# Altium schematic sheet MD070B_DRIVER.SchDoc
size 431 x 279 mm; Date: Not shown in title block; ApprovedBy: Not shown in title block; CheckedBy: Not shown in title block; Author: Not shown in title block; CompanyName: Not shown in title block; Engineer: Not shown in title block; Organization: Not shown in title block; Address1: Not shown in title block; Address2: Not shown in title block; Address3: Not shown in title block; Address4: Not shown in title block; DocumentNumber: 2; Revision: Use project parameter SCH_Rev; SheetNumber: 3; SheetTotal: 5; PageSetup: Record=PageOptions|CenterHorizontal=True|CenterVertical=True|PrintScale=1.00|XCorrection=1.00|YCorrection=1.00|PrintKind=0|BorderSize=5000000|LeftOffset=0|BottomOffset=0|Orientation=2|PaperLength=1000|PaperWidth=1000|Scale=100|PaperSource=15|PrintQuality=600|MediaType=1|DitherType=10|PaperKind=Letter|PrintScaleMode=1; CurrentTime: Not shown in title block; CurrentDate: Not shown in title block; Time: Not shown in title block; DocumentFullPathAndName: Not shown in title block; DocumentName: Not shown in title block; ModifiedDate: Not shown in title block; ImagePath: Not shown in title block
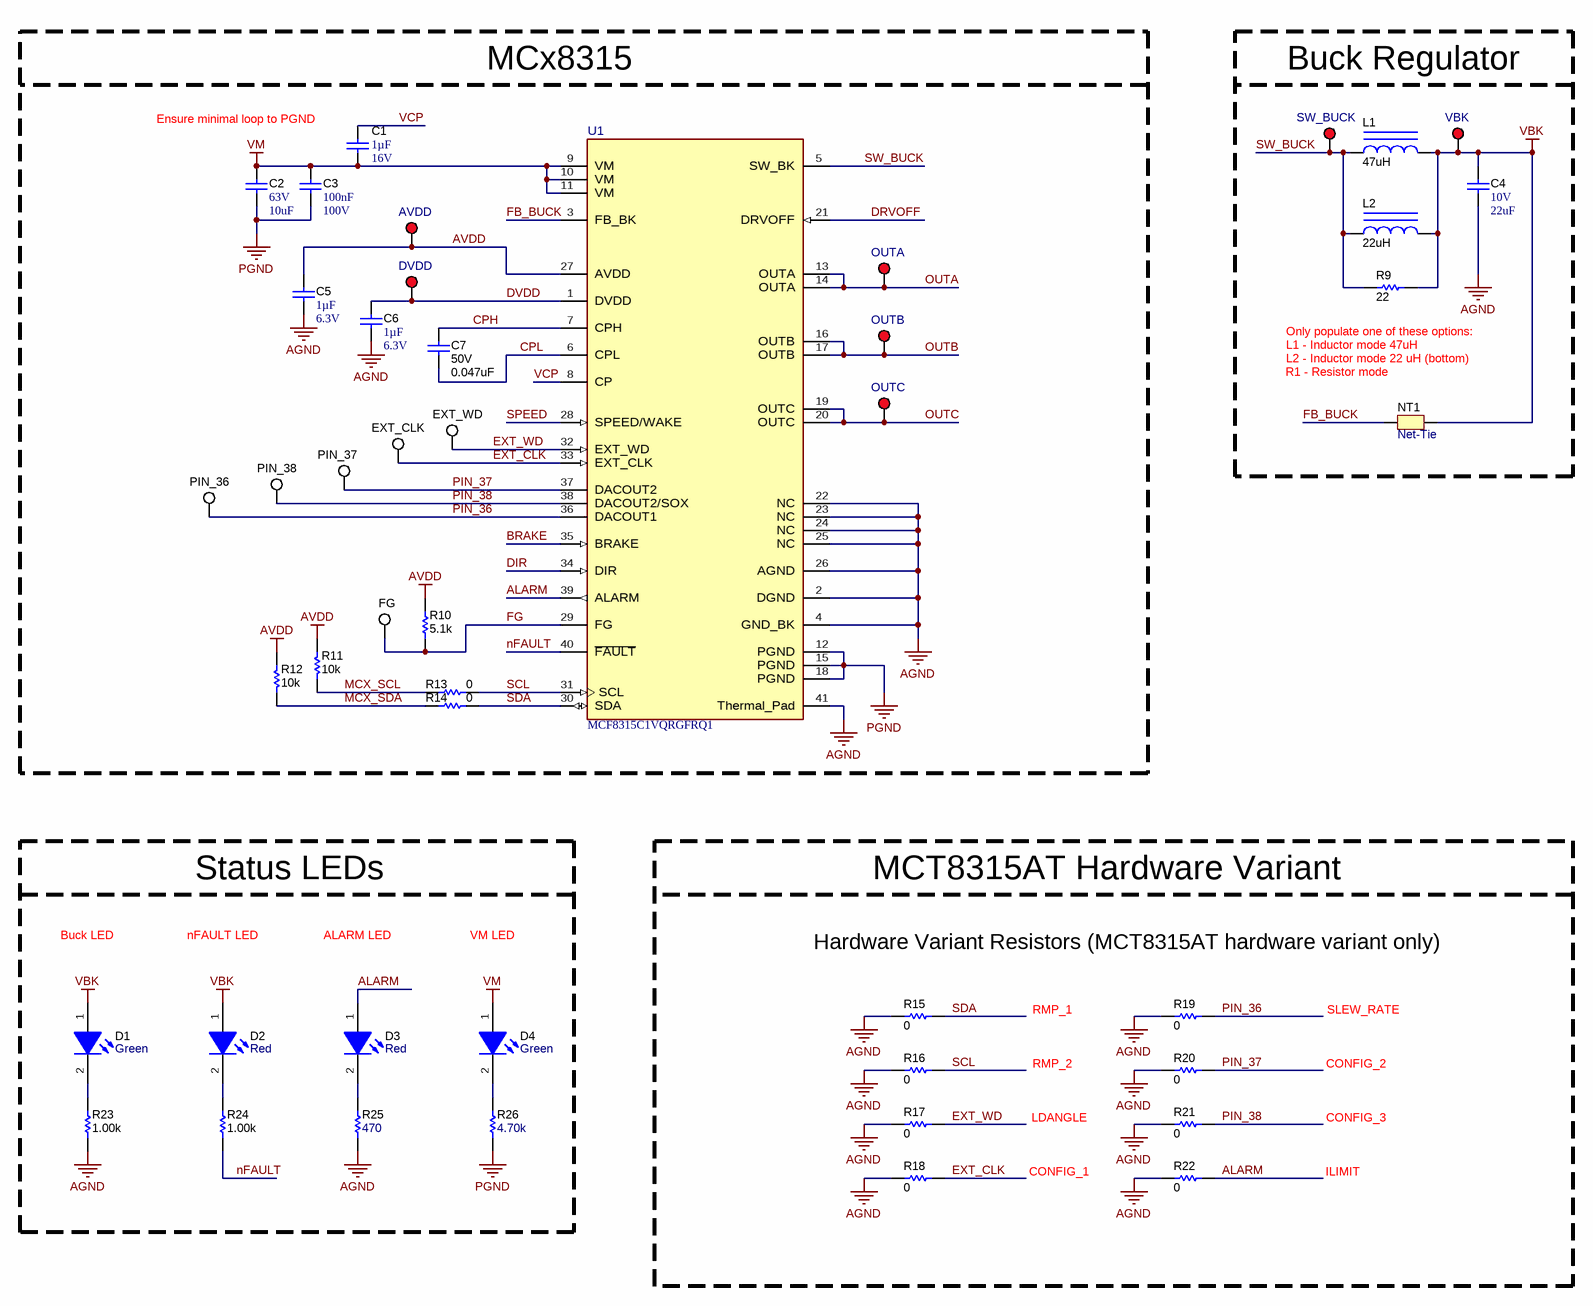
[diagram p0: MD070B_DRIVER.SchDoc]

## Parts
C1  Cap_F: 1µF  VDC_V: 16V  [0603L]  (hidden comment: EMK107B7105KAHT)
C2  VDC_V: 63V  ValueDisplayed: 10uF  [1210_270L]  (hidden comment: GRM32ER71J106KA12L)
C3  Cap_F: 100nF  VDC_V: 100V  [0603]  (hidden comment: GRM188R72A104KA35D)
C4  VDC_V: 10V  ValueDisplayed: 22uF  [1206_180L]  (hidden comment: GRM31CR71A226KE15L)
C5  Cap_F: 1µF  VDC_V: 6.3V  [0603L]  (hidden comment: C0603C105K9RACAUTO)
C6  Cap_F: 1µF  VDC_V: 6.3V  [0603L]  (hidden comment: C0603C105K9RACAUTO)
C7  VDC_V: 50V  ValueDisplayed: 0.047uF  [0402L]  (hidden comment: C1005X7R1H473K050BB)
D1  value Green  [LTST-C170KGKT_Green]  (hidden comment: LTST-C170KGKT)
D2  value Red  [LED_LTST-C170_Red]  (hidden comment: LTST-C170KRKT)
D3  value Red  [LED_LTST-C170_Red]  (hidden comment: LTST-C170KRKT)
D4  value Green  [LTST-C170KGKT_Green]  (hidden comment: LTST-C170KGKT)
L1  ValueDisplayed: 47uH  [WE-MAIA_3015]  (hidden comment: 78438335470)
L2  ValueDisplayed: 22uH  [WE-MAIA_3015]  (hidden comment: 78438335220)
NT1  Net-Tie  [Net-Tie_10mil]  (net tie, no BOM)
R9  ValueDisplayed: 22  [2512]  (hidden comment: CRCW251222R0JNEGHP)
R10  ValueDisplayed: 5.1k  [0603L]  (hidden comment: CRCW06035K10JNEA)
R11  ValueDisplayed: 10k  [0603]  (hidden comment: CRCW060310K0JNEA)
R12  ValueDisplayed: 10k  [0603]  (hidden comment: CRCW060310K0JNEA)
R13  ValueDisplayed: 0  [0603L]  (hidden comment: ERJ-3GEY0R00V)
R14  ValueDisplayed: 0  [0603L]  (hidden comment: ERJ-3GEY0R00V)
R15  ValueDisplayed: 0  [0603L]  (hidden comment: ERJ-3GEY0R00V)
R16  ValueDisplayed: 0  [0603L]  (hidden comment: ERJ-3GEY0R00V)
R17  ValueDisplayed: 0  [0603L]  (hidden comment: ERJ-3GEY0R00V)
R18  ValueDisplayed: 0  [0603L]  (hidden comment: ERJ-3GEY0R00V)
R19  ValueDisplayed: 0  [0603L]  (hidden comment: ERJ-3GEY0R00V)
R20  ValueDisplayed: 0  [0603L]  (hidden comment: ERJ-3GEY0R00V)
R21  ValueDisplayed: 0  [0603L]  (hidden comment: ERJ-3GEY0R00V)
R22  ValueDisplayed: 0  [0603L]  (hidden comment: ERJ-3GEY0R00V)
R23  ValueDisplayed: 1.00k  [0603]  (hidden comment: RC0603FR-071KL)
R24  ValueDisplayed: 1.00k  [0603]  (hidden comment: RC0603FR-071KL)
R25  ValueDisplayed: 470  [0603]  (hidden comment: RC0603JR-07470RL)
R26  ValueDisplayed: 4.70k  [0603L]  (hidden comment: RT0603BRD074K7L)
TP5  SW_BUCK  [Keystone5000]
TP6  VBK  [Keystone5000]
TP7  AVDD  [Keystone5000]
TP8  DVDD  [Keystone5000]
TP9  OUTA  [Keystone5000]
TP10  OUTB  [Keystone5000]
TP11  OUTC  [Keystone5000]
TP12  EXT_WD  [Keystone5002]
TP13  EXT_CLK  [Keystone5002]
TP14  PIN_37  [Keystone5002]
TP15  PIN_38  [Keystone5002]
TP16  PIN_36  [Keystone5002]
TP17  FG  [Keystone5002]
U1  MCF8315C1VQRGFRQ1  [RGF0040F-MFG]

## Blocks framed on the sheet
MCx8315: C1-C3 C5-C7 R10-R14 TP7-TP17 U1
Buck Regulator: C4 L1 L2 NT1 R9 TP5 TP6
Status LEDs: D1-D4 R23-R26
MCT8315AT Hardware Variant: R15-R22

## Nets
AGND: C4.2 C5.1 C6.1 R15.2 R16.2 R17.2 R18.2 R19.2 R20.2 R21.2 R22.2 R23.1 R25.1 U1.2(DGND) U1.4(GND_BK) U1.22(NC) U1.23(NC) U1.24(NC) U1.25(NC) U1.26(AGND) U1.41(Thermal_Pad)
AVDD: C5.2 R10.2 R11.1 R12.1 TP7.1 U1.27(AVDD)
PGND: C2.2 C3.2 R26.1 U1.12(PGND) U1.15(PGND) U1.18(PGND)
VBK: C4.1 D1.1(A) D2.1(A) L1.2 L2.2 NT1.2 R9.2 TP6.1
VM: C1.2 C2.1 C3.1 D4.1(A) U1.9(VM) U1.10(VM) U1.11(VM)
ALARM: D3.1(A) R22.1 U1.39(ALARM)
BRAKE: U1.35(BRAKE)
CPH: C7.1 U1.7(CPH)
CPL: C7.2 U1.6(CPL)
DIR: U1.34(DIR)
DRVOFF: U1.21(DRVOFF)
DVDD: C6.2 TP8.1 U1.1(DVDD)
EXT_CLK: R18.1 TP13.1 U1.33(EXT_CLK)
EXT_WD: R17.1 TP12.1 U1.32(EXT_WD)
FB_BUCK: NT1.1 U1.3(FB_BK)
FG: R10.1 TP17.1 U1.29(FG)
MCX_SCL: R11.2 R13.1
MCX_SDA: R12.2 R14.1
nFAULT: R24.1 U1.40(~{FAULT})
OUTA: TP9.1 U1.13(OUTA) U1.14(OUTA)
OUTB: TP10.1 U1.16(OUTB) U1.17(OUTB)
OUTC: TP11.1 U1.19(OUTC) U1.20(OUTC)
PIN_36: R19.1 TP16.1 U1.36(DACOUT1)
PIN_37: R20.1 TP14.1 U1.37(DACOUT2)
PIN_38: R21.1 TP15.1 U1.38(DACOUT2/SOX)
SCL: R13.2 R16.1 U1.31(SCL)
SDA: R14.2 R15.1 U1.30(SDA)
SPEED: U1.28(SPEED/WAKE)
SW_BUCK: L1.1 L2.1 R9.1 TP5.1 U1.5(SW_BK)
VCP: C1.1 U1.8(CP)
NetD1_2: D1.2(K) R23.2
NetD2_2: D2.2(K) R24.2
NetD3_2: D3.2(K) R25.2
NetD4_2: D4.2(K) R26.2

## Notes on the sheet
- Ensure minimal loop to PGND
- (near NT1) R1 - Resistor mode
- L1 - Inductor mode 47uH
- L2 - Inductor mode 22 uH (bottom)
- (near R9) Only populate one of these options:
- Buck LED
- nFAULT LED
- ALARM LED
- VM LED
- Hardware Variant Resistors (MCT8315AT hardware variant only)
- RMP_1
- RMP_2
- CONFIG_2
- SLEW_RATE
- LDANGLE
- CONFIG_3
- CONFIG_1
- ILIMIT
- Drawn By:
- SVN Rev:
- Number:
- TID #:
- Orderable:
- Rev:
- Sheet Title:
- File:
- Project Title:
- Designed for:
- Assembly Variant:
- Mod. Date:
- Sheet:
- Size:
- of
- B
- http://www.ti.com
- Texas Instruments and/or its licensors do not warrant the accuracy or completeness of this specification or any information contained therein. Texas Instruments and/or its licensors do not warrant that this design will meet the specifications, will be suitable for your application or fit for any particular purpose, or will operate in an implementation. Texas Instruments and/or its licensors do not warrant that the design is production worthy. You should completely validate and test your design implementation to confirm the system functionality for your application.
- Engineer:
- Contact:
- © Texas Instruments

## Library data of the parts
C1 = CMP-0080104-1: CAP, CERM, 1 µF, 16 V,+/- 10%, X7R, AEC-Q200 Grade 1, 0603; Manufacturer: Taiyo Yuden; SizeAreaWB_mm2: 4.68; SizeArea_mm2: 1.28; AEC Qualified: Y; AEC Category: Q200; Value: 1uF; TaMax_C: 125°C; SizeZ_mm: 1; Polarized: N; TaMin_C: -55°C; SizeY_mm: 0.8; U/M: EA; SizeX_mm: 1.6; Cap_Case: 0603; ComponentLink1Description: Datasheet link; RoHS: Y; Supplier Part Number 3: 963-EMK107B7105KAHT; Tolerance_%: 10%; Supplier 1: Digi-Key; PackageReference: 0603; Technology: Ceramic; PartNumber: EMK107B7105KAHT; TempCo: X7R; Supplier Part Number 2: 68X1305; Supplier 2: Newark; AEC Grade: 1; Value2: 16V; ComponentLink1URL: https://www.yuden.co.jp/productdata/catalog/mlcc01_hq_e.pdf; CompType: Capacitor; MountType: SMT; Supplier Part Number 1: 587-3305-1-ND; Supplier 3: Mouser; ValueDisplayed: 1µF
C2 = CMP-0009229-2: CAP, CERM, 10 uF, 63 V, +/- 10%, X7R, 1210; Manufacturer: MuRata; TaMin_C: -55°C; Polarized: N; SizeAreaWB_mm2: 14.7; Value1: Unknown; U/M: EA; Value: 10uF; TaMax_C: 125°C; SizeZ_mm: 2.7; SizeX_mm: 3.2; SizeY_mm: 2.5; Cap_Case: 1210; SizeArea_mm2: 8; Cap_F: 10µF; AEC Category: Q200; Supplier Part Number 2: 81-GRM32ER71J106KA2L; Publisher: Texas Instruments; Supplier 2: Mouser; TempCo: X7R; Published: 2008-06-19; RoHS: Y; MountType: SMT; Supplier 1: Digi-Key; PackageReference: 1210; Tolerance_%: 10%; Value2: 63V; CompType: Capacitor; LatestRevisionDate: 2017-03-09; PartNumber: GRM32ER71J106KA12L; AEC Qualified: N; ComponentLink1Description: Datasheet link; AEC Grade: N/A; Supplier Part Number 1: 490-9970-1-ND; Technology: Ceramic; ComponentLink1URL: http://psearch.en.murata.com/capacitor/product/GRM32ER71J106KA12%23.pdf
C3 = CMP-0007469-4: CAP, CERM, 0.1 uF, 100 V, +/- 10%, X7R, 0603; Manufacturer: MuRata; TaMin_C: -55°C; TaMax_C: 125°C; SizeY_mm: 0.8; ValueDisplayed: 0.1uF; SizeZ_mm: 1; Polarized: N; Value1: Unknown; U/M: EA; SizeAreaWB_mm2: 4.68; AEC Category: Q200; SizeArea_mm2: 1.28; Value: 0.1uF; SizeX_mm: 1.6; CompType: Capacitor; AEC Qualified: ?; Supplier 3: Farnell; Technology: Ceramic; TempCo: X7R; RoHS: Y; Cap_Case: 0603; Supplier 1: Digi-Key; Supplier Part Number 1: 490-3285-1-ND; Tolerance_%: 10%; MountType: SMT; ComponentLink1Description: Datasheet link; Supplier Part Number 2: 81-GRM188R72A104KA35; Value2: 100V; PartNumber: GRM188R72A104KA35D; Supplier 2: Mouser; ComponentLink1URL: http://search.murata.co.jp/Ceramy/PnsearchViewAction.do?HnOFG=ON&HnNFG=ON&SEL_CNT=50&sLang=en&sKey=GRM188R72A104KA35D&x=9&y=9&search=startwith; Supplier Part Number 3: 1828921; PackageReference: 0603; Publisher: Texas Instruments; Published: 2008-06-19; LatestRevisionDate: 2017-03-09
C4 = CMP-0008959-2: CAP, CERM, 22 uF, 10 V, +/- 10%, X7R, 1206; Manufacturer: MuRata; TaMin_C: -55°C; Polarized: N; SizeAreaWB_mm2: 10.92; Value1: Unknown; U/M: EA; Value: 22uF; TaMax_C: 125°C; SizeZ_mm: 1.8; SizeX_mm: 3.2; SizeY_mm: 1.6; Cap_Case: 1206; SizeArea_mm2: 5.12; Cap_F: 22µF; AEC Category: Q200; Supplier Part Number 2: 81-GRM31CR71A226K15L; Publisher: Texas Instruments; Supplier 2: Mouser; Supplier Part Number 3: 1797016; TempCo: X7R; Supplier 3: Farnell; Published: 2008-06-19; RoHS: Y; MountType: SMT; Supplier 1: Digi-Key; PackageReference: 1206; Tolerance_%: 10%; Value2: 10V; CompType: Capacitor; LatestRevisionDate: 2017-03-09; PartNumber: GRM31CR71A226KE15L; AEC Qualified: ?; ComponentLink1Description: Datasheet link; Supplier Part Number 1: 490-5309-1-ND; Technology: Ceramic; ComponentLink1URL: http://search.murata.co.jp/Ceramy/PnsearchViewAction.do?HnOFG=ON&HnNFG=ON&SEL_CNT=50&sLang=en&sKey=GRM31CR71A226KE15L&x=9&y=9&search=startwith
C5 C6 = CMP-0086190-1: CAP, CERM, 1 µF, 6.3 V,+/- 10%, X7R, AEC-Q200 Grade 1, 0603; Manufacturer: Kemet; SizeArea_mm2: 1.28; Cap_Case: 0603; SizeY_mm: 0.8; AEC Category: Q200; AEC Qualified: Y; TaMax_C: 125°C; SizeZ_mm: 1; SizeX_mm: 1.6; Polarized: N; Value: 1uF; SizeAreaWB_mm2: 4.68; TaMin_C: -55°C; U/M: EA; ComponentLink1URL: https://content.kemet.com/datasheets/KEM_C1023_X7R_AUTO_SMD.pdf; CompType: Capacitor; PackageReference: 0603; Value2: 6.3V; Technology: Ceramic; RoHS: Y; MountType: SMT; PartNumber: C0603C105K9RACAUTO; AEC Grade: 1; ComponentLink1Description: Datasheet link; TempCo: X7R; Tolerance_%: 10%; ValueDisplayed: 1µF
C7 = CMP-0006298-2: CAP, CERM, 0.047 uF, 50 V, +/- 10%, X7R, 0402; Manufacturer: TDK; TaMin_C: -55°C; ESR_ohm: 0.06407; Polarized: N; SizeAreaWB_mm2: 3; Value1: 0.06407 ohm; U/M: EA; SizeZ_mm: 0.6; SizeX_mm: 1; SizeY_mm: 0.5; Cap_Case: 0402; Cap_F: 47nF; IRMS_A: 646.122mA; AEC Category: Q200; TaMax_C: 125°C; ComponentLink1URL: https://product.tdk.com/en/search/capacitor/ceramic/mlcc/info?part_no=C1005X7R1H473K050BB; Supplier Part Number 2: 04X3233; Publisher: Texas Instruments; Supplier 2: Newark; Supplier Part Number 3: 810-C1005X7R1H473K; TempCo: X7R; Supplier 3: Mouser; Published: 2008-06-19; RoHS: Y; MountType: SMT; Value: 0.047uF; Supplier 1: Digi-Key; PackageReference: 0402; Tolerance_%: 10%; Value2: 50V; SizeArea_mm2: 0.5; CompType: Capacitor; LatestRevisionDate: 2017-03-09; PartNumber: C1005X7R1H473K050BB; AEC Qualified: N; ComponentLink1Description: Datasheet link; AEC Grade: N/A; Supplier Part Number 1: 445-7336-1-ND; Technology: Ceramic
D1 D4 = CMP-0002888-2: LED, Green, SMD; Manufacturer: Lite-On; Io_A: 20mA; Value1: W; Vf_V: 2V; Type: AlInGaP; ComponentLink1URL: http://optoelectronics.liteon.com/upload/download/DS22-2000-073/S_110_LTST-C170KGKT.pdf; Color: Green; RoHS: Y; MountType: SMT; PackageReference: LED_0805; Value2: 2V; CompType: LED; PartNumber: LTST-C170KGKT; ComponentLink1Description: Datasheet link
D2 D3 = CMP-0002829-3: LED, Red, SMD; Manufacturer: Lite-On; Io_A: 20mA; SizeAreaWB_mm2: 6.75; Value1: W; SizeZ_mm: 1.2; SizeX_mm: 2; SizeY_mm: 1.25; Vf_V: 2V; SizeArea_mm2: 2.5; Type: AlInGaP; ComponentLink1URL: http://optoelectronics.liteon.com/upload/download/DS-22-99-0150/P_100_LTST-C170KRKT.pdf; Color: red; RoHS: Y; MountType: SMT; PackageReference: Red 0805 LED; Value2: 2V; CompType: LED; PartNumber: LTST-C170KRKT; ComponentLink1Description: Datasheet link
L1 = CMP-0064683-2: Inductor, Shielded, Powdered Iron, 47 uH, 0.39 A, 2.3 ohm, AEC-Q200 Grade 1, SMD; Manufacturer: Wurth Elektronik; Isat: 1.18A @ 20% inductance drop; Irms: 0.39A @ 40C rise; SizeAreaWB_mm2: 16; DCR_ohm: 2.3; Value1: 2.3 ohm; Value: 47uH; Imax_A: 390mA; SizeZ_mm: 1.5; SizeX_mm: 3; Value2: 0.39A; SizeArea_mm2: 9; Ind_H: 47µH; AEC Qualified: Y; AEC Grade: 1; AEC Category: Q200; Publisher: Texas Instruments; Published: 2008-06-26; RoHS: Y; Material: Powdered Iron; MountType: SMT; Supplier 1: Digi-Key; PackageReference: SMD, 2-Leads, Body 3x3mm; SizeY_mm: 3; CompType: Inductor; LatestRevisionDate: 2017-06-02; PartNumber: 78438335470; ComponentLink1Description: Datasheet link; Supplier Part Number 1: 732-6947-1-ND; Technology: Shielded; ComponentLink1URL: http://katalog.we-online.de/pbs/datasheet/78438335470.pdf
L2 = CMP-0064681-2: Inductor, Shielded, Powdered Iron, 22 uH, 0.6 A, 1.04 ohm, AEC-Q200 Grade 1, SMD; Manufacturer: Wurth Elektronik; Isat: 1.6A @ 20% inductance drop; Irms: 0.6A @ 40C rise; SizeAreaWB_mm2: 16; DCR_ohm: 1.04; Value: 22uH; Imax_A: 600mA; SizeZ_mm: 1.5; SizeX_mm: 3; Value2: 0.6A; SizeArea_mm2: 9; Ind_H: 22µH; AEC Qualified: Y; AEC Grade: 1; AEC Category: Q200; Publisher: Texas Instruments; Published: 2008-06-26; RoHS: Y; Value1: 1.04 ohm; Material: Powdered Iron; MountType: SMT; Supplier 1: Digi-Key; PackageReference: SMD, 2-Leads, Body 3x3mm; SizeY_mm: 3; CompType: Inductor; LatestRevisionDate: 2017-06-02; PartNumber: 78438335220; ComponentLink1Description: Datasheet link; Supplier Part Number 1: 732-6945-1-ND; Technology: Shielded; ComponentLink1URL: http://katalog.we-online.de/pbs/datasheet/78438335220.pdf
NT1 = CMP-0078142-4: Single point connection between nets.; MountType: SMT; PackageReference: N/A; CompType: Net-Tie; Manufacturer: N/A; PartNumber: N/A; Library Reference: Net-Tie
R9 = CMP-0015919-3: RES, 22, 5%, 1.5 W, AEC-Q200 Grade 0, 2512; Manufacturer: Vishay-Dale; Power_W: 1.5W; TempCo: 200 ppm/C; Value_Code: 22R0; Value: 22; EIA_Code: E24; SizeX_mm: 6.3; SizeY_mm: 3.2; SizeZ_mm: 0.71; SizeArea_mm2: 20.16; AEC Qualified: Y; VDC_V: 500V; AEC Category: Q200; AEC Grade: 0; RoHS: E; Value1: 5%; MountType: SMT; PackageReference: 2512; Tolerance_%: 5%; Res_ohm: 22; Value2: 1.5W; CompType: Resistor; PartNumber: CRCW251222R0JNEGHP; ComponentLink1Description: Datasheet link; Technology: Thick Film; ComponentLink1URL: http://www.vishay.com/docs/20043/crcwhpe3.pdf
R10 = CMP-0025830-4: RES, 5.1 k, 5%, 0.1 W, AEC-Q200 Grade 0, 0603; Manufacturer: Vishay-Dale; Power_W: 100mW; TempCo: 200 ppm/C; Value_Code: 5k10; Value: 5.1k; EIA_Code: E24; SizeX_mm: 1.6; SizeY_mm: 0.8; SizeZ_mm: 1; Value2: 0.1W; SizeArea_mm2: 1.28; AEC Qualified: Y; VDC_V: 75V; AEC Category: Q200; AEC Grade: 0; ComponentLink1URL: http://www.vishay.com/docs/20035/dcrcwe3.pdf; Supplier Part Number 2: 89M6773; Supplier 2: Newark; Supplier Part Number 3: 1570751; Supplier 3: Farnell; RoHS: E; Value1: 5%; MountType: SMT; Supplier 1: Digi-Key; PackageReference: 0603; Tolerance_%: 5%; Res_ohm: 5.1k; CompType: Resistor; PartNumber: CRCW06035K10JNEA; ComponentLink1Description: Datasheet link; Supplier Part Number 1: 541-5.1KGCT-ND; Technology: Thick Film
R11 R12 = CMP-0025701-4: RES, 10 k, 5%, 0.1 W, AEC-Q200 Grade 0, 0603; Manufacturer: Vishay-Dale; Power_W: 100mW; TempCo: 200 ppm/C; Value_Code: 10k0; Value: 10k; EIA_Code: E24; SizeX_mm: 1.6; SizeY_mm: 0.8; SizeZ_mm: 1; Value2: 0.1W; SizeArea_mm2: 1.28; AEC Qualified: Y; VDC_V: 75V; AEC Category: Q200; AEC Grade: 0; Supplier Part Number 2: 52K8066; Supplier 2: Newark; Supplier Part Number 3: 71-CRCW0603J-10K-E3; Supplier 3: Mouser; RoHS: E; Value1: 5%; MountType: SMT; Supplier 1: Digi-Key; PackageReference: 0603; Tolerance_%: 5%; Res_ohm: 10k; CompType: Resistor; PartNumber: CRCW060310K0JNEA; ComponentLink1Description: Datasheet link; Supplier Part Number 1: 541-10KGCT-ND; Technology: Thick Film; ComponentLink1URL: http://www.vishay.com/docs/20035/dcrcwe3.pdf
R13-R22 = CMP-0025874-4: RES, 0, 5%, 0.1 W, AEC-Q200 Grade 0, 0603; Manufacturer: Panasonic; Power_W: 100mW; TempCo: 600 ppm/C; Value_Code: 0000; Value: 0; EIA_Code: E24; SizeX_mm: 1.6; SizeY_mm: 0.8; SizeZ_mm: 1; Value2: 0.1W; SizeArea_mm2: 1.28; AEC Qualified: Y; VDC_V: 50V; AEC Category: Q200; SizeAreaWB_mm2: 4.68; Supplier Part Number 2: 667-ERJ-3GEY0R00V; Supplier 2: Mouser; Supplier Part Number 3: 2059527; Supplier 3: Farnell; RoHS: Y; Value1: 5%; MountType: SMT; Supplier 1: Digi-Key; PackageReference: 0603; Tolerance_%: 5%; Res_ohm: 0; CompType: Resistor; PartNumber: ERJ-3GEY0R00V; ComponentLink1Description: Datasheet link; Supplier Part Number 1: P0.0GCT-ND; Technology: Thick Film; ComponentLink1URL: https://industrial.panasonic.com/cdbs/www-data/pdf/RDA0000/AOA0000C301.pdf; AEC Grade: 0
R23 R24 = CMP-0022895-5: RES, 1.00 k, 1%, 0.1 W, 0603; Manufacturer: Yageo; Power_W: 100mW; TempCo: 100 ppm/C; Value_Code: 1k00; Value: 1.00k; EIA_Code: E96; Res_ohm: 1k; SizeX_mm: 1.6; SizeY_mm: 0.8; SizeZ_mm: 1; Value2: 0.1W; SizeArea_mm2: 1.28; AEC Qualified: N; VDC_V: 75V; AEC Category: Q200; SizeAreaWB_mm2: 4.68; Supplier Part Number 2: 603-RC0603FR-071KL; Supplier 2: Mouser; Supplier Part Number 3: 9238484; Supplier 3: Farnell; RoHS: Y; Value1: 1%; MountType: SMT; Supplier 1: Digi-Key; PackageReference: 0603; Tolerance_%: 1%; CompType: Resistor; PartNumber: RC0603FR-071KL; ComponentLink1Description: Datasheet link; Supplier Part Number 1: 311-1.00KHRCT-ND; Technology: Thick Film; ComponentLink1URL: http://www.yageo.com/pdf/Pu-RC0603_51_PbFree_L_2.pdf; AEC Grade: N/A
R25 = CMP-0025924-5: RES, 470, 5%, 0.1 W, 0603; Manufacturer: Yageo; Power_W: 100mW; TempCo: 100 ppm/C; Value_Code: 470R; Value: 470; EIA_Code: E24; SizeX_mm: 1.6; SizeY_mm: 0.8; SizeZ_mm: 1; Value2: 0.1W; SizeArea_mm2: 1.28; AEC Qualified: N; VDC_V: 75V; AEC Category: Q200; SizeAreaWB_mm2: 4.68; Supplier Part Number 2: 603-RC0603JR-07470RL; Supplier 2: Mouser; Supplier Part Number 3: 9233334; Supplier 3: Farnell; RoHS: Y; Value1: 5%; MountType: SMT; Supplier 1: Digi-Key; PackageReference: 0603; Tolerance_%: 5%; Res_ohm: 470; CompType: Resistor; PartNumber: RC0603JR-07470RL; ComponentLink1Description: Datasheet link; Supplier Part Number 1: 311-470GRCT-ND; Technology: Thick Film; ComponentLink1URL: http://www.yageo.com/pdf/Pu-RC0603_51_PbFree_L_2.pdf; AEC Grade: N/A
R26 = CMP-0024300-2: RES, 4.70 k, 0.1%, 0.1 W, 0603; Manufacturer: Yageo America; Power_W: 100mW; TempCo: 25 ppm/C; Value_Code: 4k70; U/M: EA; Value: 4.70k; EIA_Code: E192; Res_ohm: 4.7k; SizeX_mm: 1.6; SizeY_mm: 0.8; SizeZ_mm: 1; Value2: 0.1W; SizeArea_mm2: 1.28; VDC_V: 75V; AEC Category: Q200; ComponentLink1URL: http://www.yageo.com/pdf/PYu-RT_1-to-0.05_RoHS_L_3.pdf; Publisher: Texas Instruments; Published: 2008-06-26; RoHS: Y; Value1: 0.1%; MountType: SMT; PackageReference: 0603; Tolerance_%: 0.1%; CompType: Resistor; LatestRevisionDate: 2017-03-09; PartNumber: RT0603BRD074K7L; AEC Qualified: ?; ComponentLink1Description: Datasheet link; Technology: Thin Film
TP5-TP11 = CMP-0055137-1: Test Point, Miniature, Red, TH; PartNumber: 5000; Manufacturer: Keystone; ContactFinish: Silver; CNHeader: FALSE; CT: TRUE; Green_Lifecycle: Active; Green_REACh: Passed; PackageReference: Red Miniature Testpoint; CompType: Test Point; RoHS: Y; MountType: TH; ComponentLink1Description: Datasheet URL; ComponentLink1URL: http://www.keyelco.com/userAssets/file/M60-2p60.pdf; Publisher: Texas Instruments; LatestRevisionDate: 26/05/2017; Supplier 1: Digi-Key; Supplier Part Number 1: 36-5000-ND; Supplier 2: Mouser; Supplier Part Number 2: 534-5000; Color: Red; Green_EU RoHS-2: Incomplete; Green_EU RoHS: Passed
TP12-TP17 = CMP-0055139-1: Test Point, Miniature, White, TH; Manufacturer: Keystone; CNHeader: FALSE; Green_Lifecycle: Active; Green_REACh: Passed; ContactFinish: Silver; CT: TRUE; ComponentLink1URL: http://www.keyelco.com/userAssets/file/M60-2p60.pdf; Supplier Part Number 2: 82H9632; Publisher: Texas Instruments; Supplier 2: Newark; Supplier Part Number 3: 534-5002; Color: White; Supplier 3: Mouser; RoHS: Y; MountType: TH; Green_EU RoHS-2: Passed; Supplier 1: Digi-Key; Green_EU RoHS: Passed; PackageReference: White Miniature Testpoint; CompType: Test Point; LatestRevisionDate: 26/05/2017; PartNumber: 5002; ComponentLink1Description: Datasheet URL; Supplier Part Number 1: 36-5002-ND
U1 = CMP-0122421-1: Sensorless Field Oriented Control (FOC) Integrated FET BLDC Driver; Manufacturer: Texas Instruments; SizeZ_mm: 1mm; AEC Qualified: Yes; AEC Grade: Grade 1; Max Supply Voltage: 35V; Min Supply Voltage: 4.5V; Motor Type: Brushless DC; Nominal Supply Current: 11-28mA; Number Of Outputs: 3; Standoff Height: 0mm; TaMax_C: +125°C; TaMin_C: -40°C; TJmax_C: +150°C; PackageReference: VQFN40; PartNumber: MCF8315C1VQRGFRQ1; RoHS: TRUE; Operating Temperature Range: -40°C to +125°C; Part Number: MCF8315C1VQRGFRQ1; datasheet: https://www.ti.com/lit/ds/symlink/mcf8315c-q1.pdf; Datasheet Path: datasheets/IC-MCF8315C1VQRGFRQ1.pdf; Digikey Description: AUTOMOTIVE, 40V MAX, 4A PEAK, SE; Digikey Part Number: 296-MCF8315C1VQRGFRQ1CT-ND; helpURL: https://upverter.com/upn/revision/513decdd14bf9ffb/; Lead Free: Yes; Mouser Part Number: 595-MCF8315C1VQRGFQ1; ComponentLink1Description: Datasheet; ComponentLink1URL: https://www.ti.com/lit/ds/symlink/mcf8315c-q1.pdf